# EAGLE design clock (EAGLE 6.4)
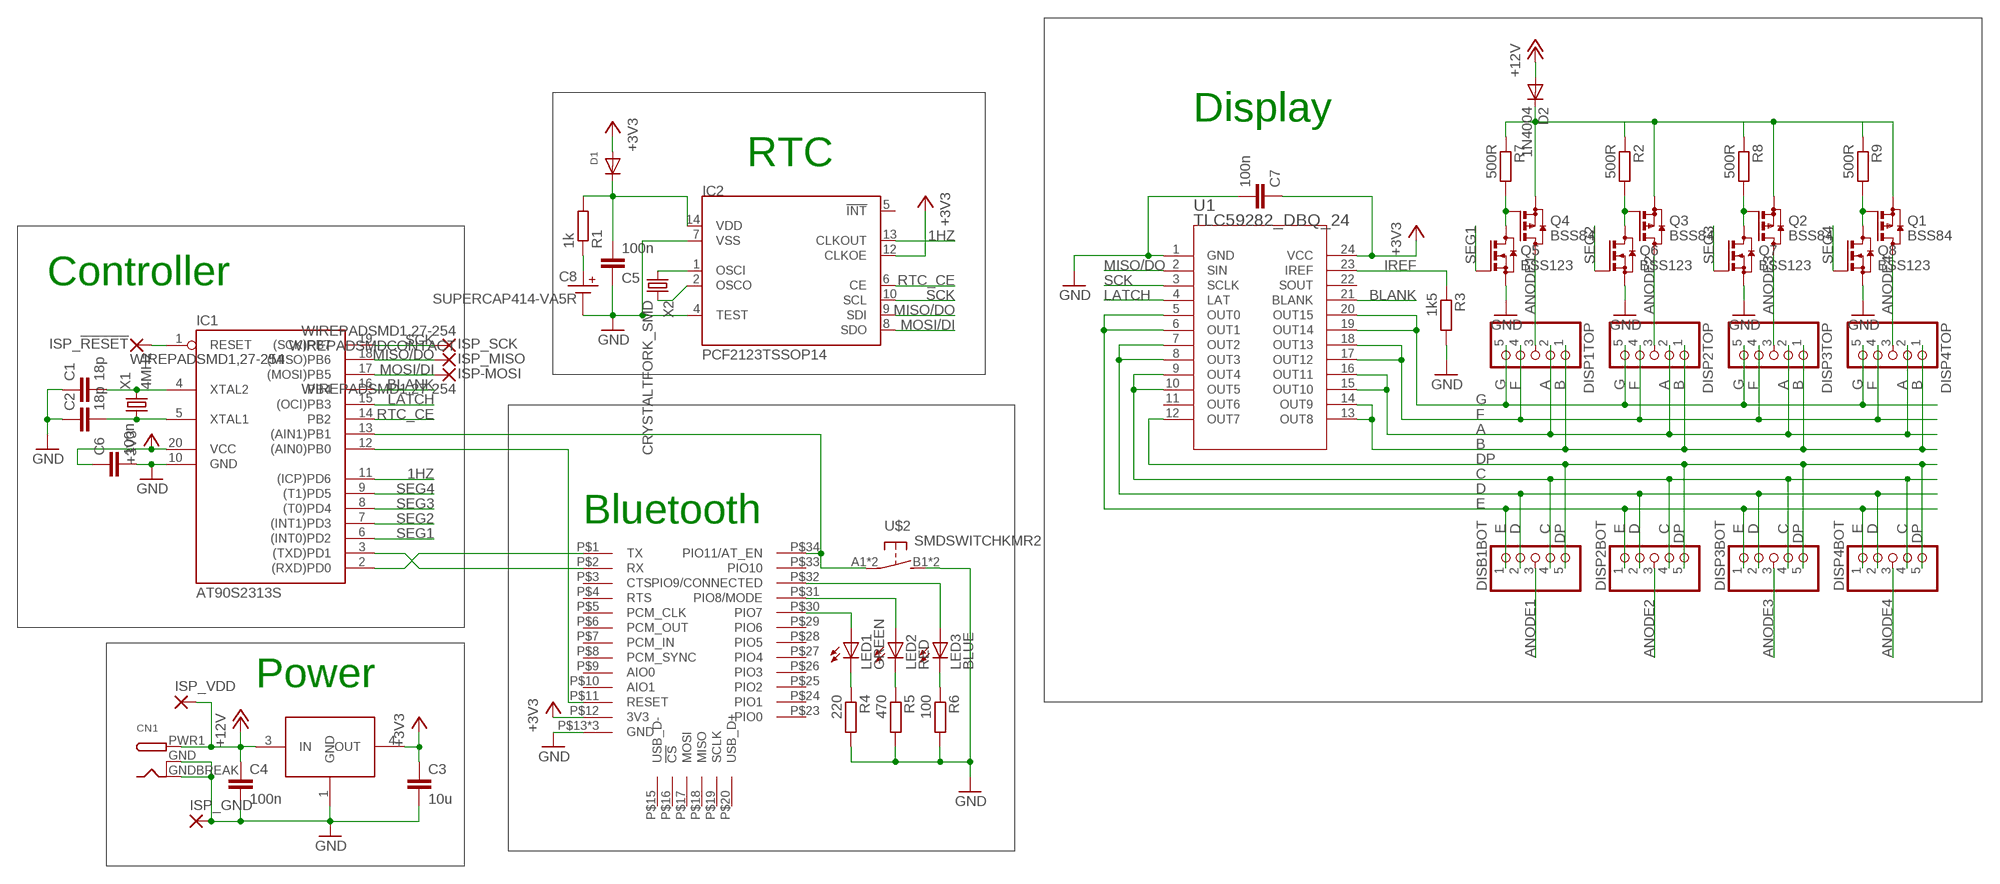
[diagram p0: schematic, sheet 1]

## Parts
C1  18p  C-EUC0603K  [C0603K]
C2  18p  C-EUC0603K  [C0603K]
C3  10u  C-EUC0805K  [C0805K]
C4  100n  C-EUC0603K  [C0603K]
C5  100n  C-EUC0603K  [C0603K]
C6  100n  C-EUC0603K  [C0603K]
C7  100n  C-EUC0603K  [C0603K]
C8  SUPERCAP414-VA5R  [414-VA5R]
CN1  DCBARRELSMT  [DCJACK_2MM_SMT]
D1  DIODESOD-523  [SOD-523]
D2  1N4004  [DO41-10]
DISB1BOT  PINHD-1X5  [1X05WIDE]
DISP1TOP  PINHD-1X5  [1X05WIDE]
DISP2BOT  PINHD-1X5  [1X05WIDE]
DISP2TOP  PINHD-1X5  [1X05WIDE]
DISP3BOT  PINHD-1X5  [1X05WIDE]
DISP3TOP  PINHD-1X5  [1X05WIDE]
DISP4BOT  PINHD-1X5  [1X05WIDE]
DISP4TOP  PINHD-1X5  [1X05WIDE]
IC1  AT90S2313S  [SO20L]
IC2  PCF2123TSSOP14  [TSSOP14]
ISP-MOSI  WIREPADSMD1,27-254  [SMD1,27-2,54]
ISP_!RESET  WIREPADSMD1,27-254  [SMD1,27-2,54]
ISP_GND  WIREPADSMD2,54-2,54  [SMD2,54-2,54]
ISP_MISO  WIREPADSMDCONTACT  [SMDCONTACT]
ISP_SCK  WIREPADSMD1,27-254  [SMD1,27-2,54]
ISP_VDD  WIREPADSMD2,54-2,54  [SMD2,54-2,54]
LED1  GREEN  LEDCHIPLED_0805  [CHIPLED_0805]
LED2  RED  LEDCHIPLED_0805  [CHIPLED_0805]
LED3  BLUE  LEDCHIPLED_0805  [CHIPLED_0805]
Q1  BSS84  [SOT23]
Q2  BSS84  [SOT23]
Q3  BSS84  [SOT23]
Q4  BSS84  [SOT23]
Q5  BSS123  [SOT23]
Q6  BSS123  [SOT23]
Q7  BSS123  [SOT23]
Q8  BSS123  [SOT23]
R1  1k  R-EU_R0603  [R0603]
R2  500R  R-EU_R0603  [R0603]
R3  1k5  R-EU_R0603  [R0603]
R4  220  R-EU_R0603  [R0603]
R5  470  R-EU_R0603  [R0603]
R6  100  R-EU_R0603  [R0603]
R7  500R  R-EU_R0603  [R0603]
R8  500R  R-EU_R0603  [R0603]
R9  500R  R-EU_R0603  [R0603]
U1  TLC59282_DBQ_24  [DBQ24]
U$1  BT-HC-05  [BT-HC-05]
U$2  SMDSWITCHKMR2  [KMR2]
U$3  REGULATORDPAK  [DPAK]
X1  4MHz  CRYSTALHC49UP  [HC49UP]
X2  CRYSTALTFORK_SMD  [TFORK_SMD]

## Nets
1HZ: IC1.11((ICP)PD6) IC2.13(CLKOUT)
+3V3: C3.1 C6.1 C7.1 D1.A IC1.20(VCC) IC2.12(CLKOE) U1.24(VCC) U$1.P$12(3V3) U$3.4(OUT)
+12V: C4.1 CN1.PWR1(PWR) D2.A ISP_VDD.1(P) U$3.3(IN)
A: DISP1TOP.2 DISP2TOP.2 DISP3TOP.2 DISP4TOP.2 U1.15(OUT10) U1.16(OUT11)
ANODE1: DISB1BOT.3 DISP1TOP.3 Q4.3(D)
ANODE2: DISP2BOT.3 DISP2TOP.3 Q3.3(D)
ANODE3: DISP3BOT.3 DISP3TOP.3 Q2.3(D)
ANODE4: DISP4BOT.3 DISP4TOP.3 Q1.3(D)
B: DISP1TOP.1 DISP2TOP.1 DISP3TOP.1 DISP4TOP.1 U1.13(OUT8) U1.14(OUT9)
BLANK: IC1.16(PB4) U1.21(BLANK)
C: DISB1BOT.4 DISP2BOT.4 DISP3BOT.4 DISP4BOT.4 U1.9(OUT4) U1.10(OUT5)
D: DISB1BOT.2 DISP2BOT.2 DISP3BOT.2 DISP4BOT.2 U1.7(OUT2) U1.8(OUT3)
DP: DISB1BOT.5 DISP2BOT.5 DISP3BOT.5 DISP4BOT.5 U1.12(OUT7)
E: DISB1BOT.1 DISP2BOT.1 DISP3BOT.1 DISP4BOT.1 U1.5(OUT0) U1.6(OUT1)
F: DISP1TOP.4 DISP2TOP.4 DISP3TOP.4 DISP4TOP.4 U1.17(OUT12) U1.18(OUT13)
G: DISP1TOP.5 DISP2TOP.5 DISP3TOP.5 DISP4TOP.5 U1.19(OUT14) U1.20(OUT15)
GND: C1.1 C2.1 C3.2 C4.2 C5.1 C6.2 C7.2 C8.MINUS CN1.GND(GNDBREAK) CN1.GNDBREAK(GND) IC1.10(GND) IC2.4(TEST) IC2.7(VSS) ISP_GND.1(P) Q5.2(S) Q6.2(S) Q7.2(S) Q8.2(S) R3.2 R4.2 R5.2 R6.2 U1.1(GND) U$1.P$13(GND) U$1.P$21(GND) U$1.P$22(GND) U$2.B1(S) U$2.B2(S) U$3.1(GND)
IREF: R3.1 U1.23(IREF)
LATCH: IC1.15((OCI)PB3) U1.4(LAT)
MISO/DO: IC1.18((MISO)PB6) IC2.9(SDI) ISP_MISO.1(P) U1.2(SIN)
MOSI/DI: IC1.17((MOSI)PB5) IC2.8(SDO) ISP-MOSI.1(P)
N$1: IC1.2((RXD)PD0) U$1.P$1(TX)
N$2: IC1.3((TXD)PD1) U$1.P$2(RX)
N$3: IC2.2(OSCO) X2.3
N$4: IC2.1(OSCI) X2.2
N$5: C2.2 IC1.5(XTAL1) X1.1
N$6: C1.2 IC1.4(XTAL2) X1.2
N$7: IC1.1(RESET) ISP_!RESET.1(P)
N$8: IC1.13((AIN1)PB1) U$1.P$34(PIO11/AT_EN) U$2.A1(P) U$2.A2(P)
N$9: C8.PLUS R1.1
N$10: IC1.12((AIN0)PB0) U$1.P$11(RESET)
N$11: D2.C Q1.2(S) Q2.2(S) Q3.2(S) Q4.2(S) R2.1 R7.1 R8.1 R9.1
N$13: LED1.C R4.1
N$14: LED2.C R5.1
N$15: LED3.C R6.1
N$16: LED3.A U$1.P$32(PIO9/CONNECTED)
N$17: LED2.A U$1.P$31(PIO8/MODE)
N$18: LED1.A U$1.P$30(PIO7)
N$28: Q1.1(G) Q8.3(D) R9.2
N$29: Q2.1(G) Q7.3(D) R8.2
N$30: Q3.1(G) Q6.3(D) R2.2
N$31: Q4.1(G) Q5.3(D) R7.2
RTC_CE: IC1.14(PB2) IC2.6(CE)
SCK: IC1.19((SCK)PB7) IC2.10(SCL) ISP_SCK.1(P) U1.3(SCLK)
SEG1: IC1.6((INT0)PD2) Q5.1(G)
SEG2: IC1.7((INT1)PD3) Q6.1(G)
SEG3: IC1.8((T0)PD4) Q7.1(G)
SEG4: IC1.9((T1)PD5) Q8.1(G)
VRTC: C5.2 D1.K(C) IC2.14(VDD) R1.2
Unconnected: IC2.5(!INT) U1.11(OUT6) U1.22(SOUT) U$1.P$3(CTS) U$1.P$4(RTS) U$1.P$5(PCM_CLK) U$1.P$6(PCM_OUT) U$1.P$7(PCM_IN) U$1.P$8(PCM_SYNC) U$1.P$9(AIO0) U$1.P$10(AIO1) U$1.P$15(USB_D-) U$1.P$16(!CS) U$1.P$17(MOSI) U$1.P$18(MISO) U$1.P$19(SCLK) U$1.P$20(USB_D+) U$1.P$23(PIO0) U$1.P$24(PIO1) U$1.P$25(PIO2) U$1.P$26(PIO3) U$1.P$27(PIO4) U$1.P$28(PIO5) U$1.P$29(PIO6) U$1.P$33(PIO10)

## Notes on the sheet
- Display
- RTC
- Controller
- Bluetooth
- Power

## Library data of the parts
C1-C7 = rcl:C-EU: CAPACITOR, European symbol
C8 = jocki:SUPERCAP
CN1 = adafruit:DCBARREL: 2.0mm DC Barrel Jack DCJACK_2MM_PTH - Through Hole Jack (4UConnector: 05537)
D1 = adafruit:DIODE: Diode SMADIODE - SMA Surface Mount Package 20V 1A Schottky Diode Digikey: 641-1014-6-ND DO-1N4148 - Through Hole Small Current Diode SOD-123 20V 1 A (.5mV Vf) Schottky Diode - Digikey: MBRX120TPMSCT-ND SOD-323 10V 570mA (.38mV Vf, 3ns) Schottky Diode - Digikey: ZLLS410CT-ND SOD-523 30V 30mA Schottky Diode (RB751S-40TE61) - Digikey: RB751S-40TE61CT-ND SOT23-R/W - SOT23 Package (R = Solder Paste/Reflow Ovens, W = Hand-Soldering) BAT54Film 40V 300mA - Digikey: 497-7162-1-ND
D2 = adafruit:1N4004: DIODE General purpose 1N400x type rectifier (With bigger pads) http://www.ladyada.net/library/pcb/eaglelibrary.html
DISB1BOT DISP1TOP DISP2BOT DISP2TOP DISP3BOT DISP3TOP DISP4BOT DISP4TOP = tlc59282dbq:PINHD-1X5: PIN HEADER
IC1 = atmel:AT90S2313: MICROCONTROLLER 2 Kbytes FLASH 128 bytes SRAM 128 bytes EEPROM UART; OC_FARNELL: unknown; OC_NEWARK: unknown
IC2 = jocki:PCF2123: edit this description Auto generated by make-symbol-device-package-bsdl.ulp Rev. 43 Source:
ISP-MOSI ISP_!RESET ISP_GND ISP_MISO ISP_SCK ISP_VDD = jocki:WIREPAD: Wire PAD connect wire on PCB
LED1-LED3 = adafruit:LED: LED OSRAM: - CHIPLED LG R971, LG N971, LY N971, LG Q971, LY Q971, LO R971, LY R971 LH N974, LH R974 LS Q976, LO Q976, LY Q976 LO Q996 - Hyper CHIPLED LW Q18S LB Q993, LB Q99A, LB R99A - SideLED LS A670, LO A670, LY A670, LG A670, LP A670 LB A673, LV A673, LT A673, LW A673 LH A674 LY A675 LS A676, LA A676, LO A676, LY A676, LW A676 LS A679, LY A679, LG A679 - Hyper Micro SIDELED® LS Y876, LA Y876, LO Y876, LY Y876 LT Y87S - SmartLED LW L88C, LW L88S LB L89C, LB L89S, LG L890 LS L89K, LO L89K, LY L89K LS L896, LA L896, LO L896, LY L896 - TOPLED LS T670, LO T670, LY T670, LG T670, LP T670 LSG T670, LSP T670, LSY T670, LOP T670, LYG T670 LG T671, LOG T671, LSG T671 LB T673, LV T673, LT T673, LW T673 LH T674 LS T676, LA T676, LO T676, LY T676, LB T676, LH T676, LSB T676, LW T676 LB T67C, LV T67C, LT T67C, LS T67K, LO T67K, LY T67K, LW E67C LS E67B, LA E67B, LO E67B, LY E67B, LB E67C, LV E67C, LT E67C LW T67C LS T679, LY T679, LG T679 LS T770, LO T770, LY T770, LG T770, LP T770 LB T773, LV T773, LT T773, LW T773 LH T774 LS E675, LA E675, LY E675, LS T675 LS T776, LA T776, LO T776, LY T776, LB T776 LHGB T686 LT T68C, LB T68C - Hyper Mini TOPLED® LB M676 - Mini TOPLED Santana® LG M470 LS M47K, LO M47K, LY M47K Source: http://www.osram.convergy.de/
Q1-Q4 = transistor-small-signal:BSS84: P-CHANNEL MOS FET
Q5-Q8 = transistor-small-signal:BSS123: N-CHANNEL MOS FET
R1-R9 = rcl:R-EU_: RESISTOR, European symbol
U1 = tlc59282dbq:TLC59282_DBQ_24; DATASHEETURL: http://www.ti.com/lit/gpn/TLC59282; DESCRIPTION: 16-Channel Constant Current LED Driver with 4-Channel Grouped Delay; FAMILY_NAME: LED DRIVER; GENERIC_PART_NUMBER: TLC59282; INDUSTRY_STD_PKG_TYPE: SSOP/QSOP; MANUFACTURER: Texas Instruments; MANUFACTURER_PART_NUMBER: tlc59282_dbq_24; PACKAGE_DESIGNATOR: DBQ; PIN_COUNT: 24; VENDOR: Texas Instruments
U$1 = jocki:BT-HC-05
U$2 = jocki:SMDSWITCH
U$3 = jocki:REGULATOR
X1 = crystal:CRYSTAL: CRYSTAL; OC_FARNELL: unknown; OC_NEWARK: unknown
X2 = jocki:CRYSTAL

## Board
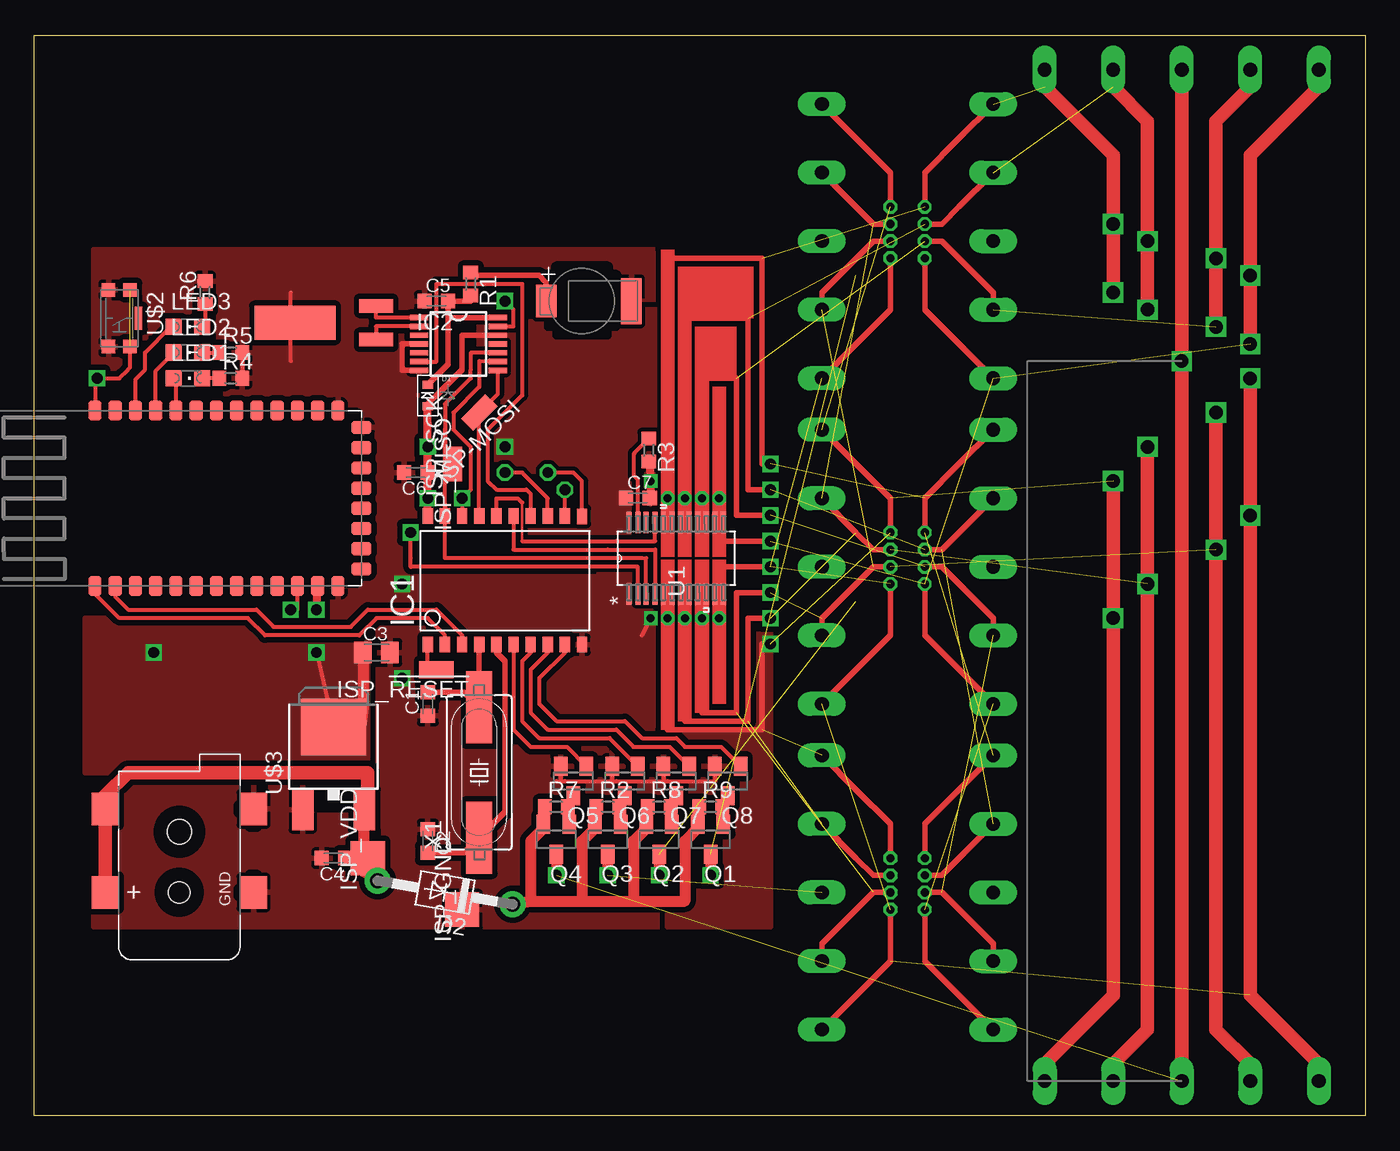
[diagram p1: board, top side]
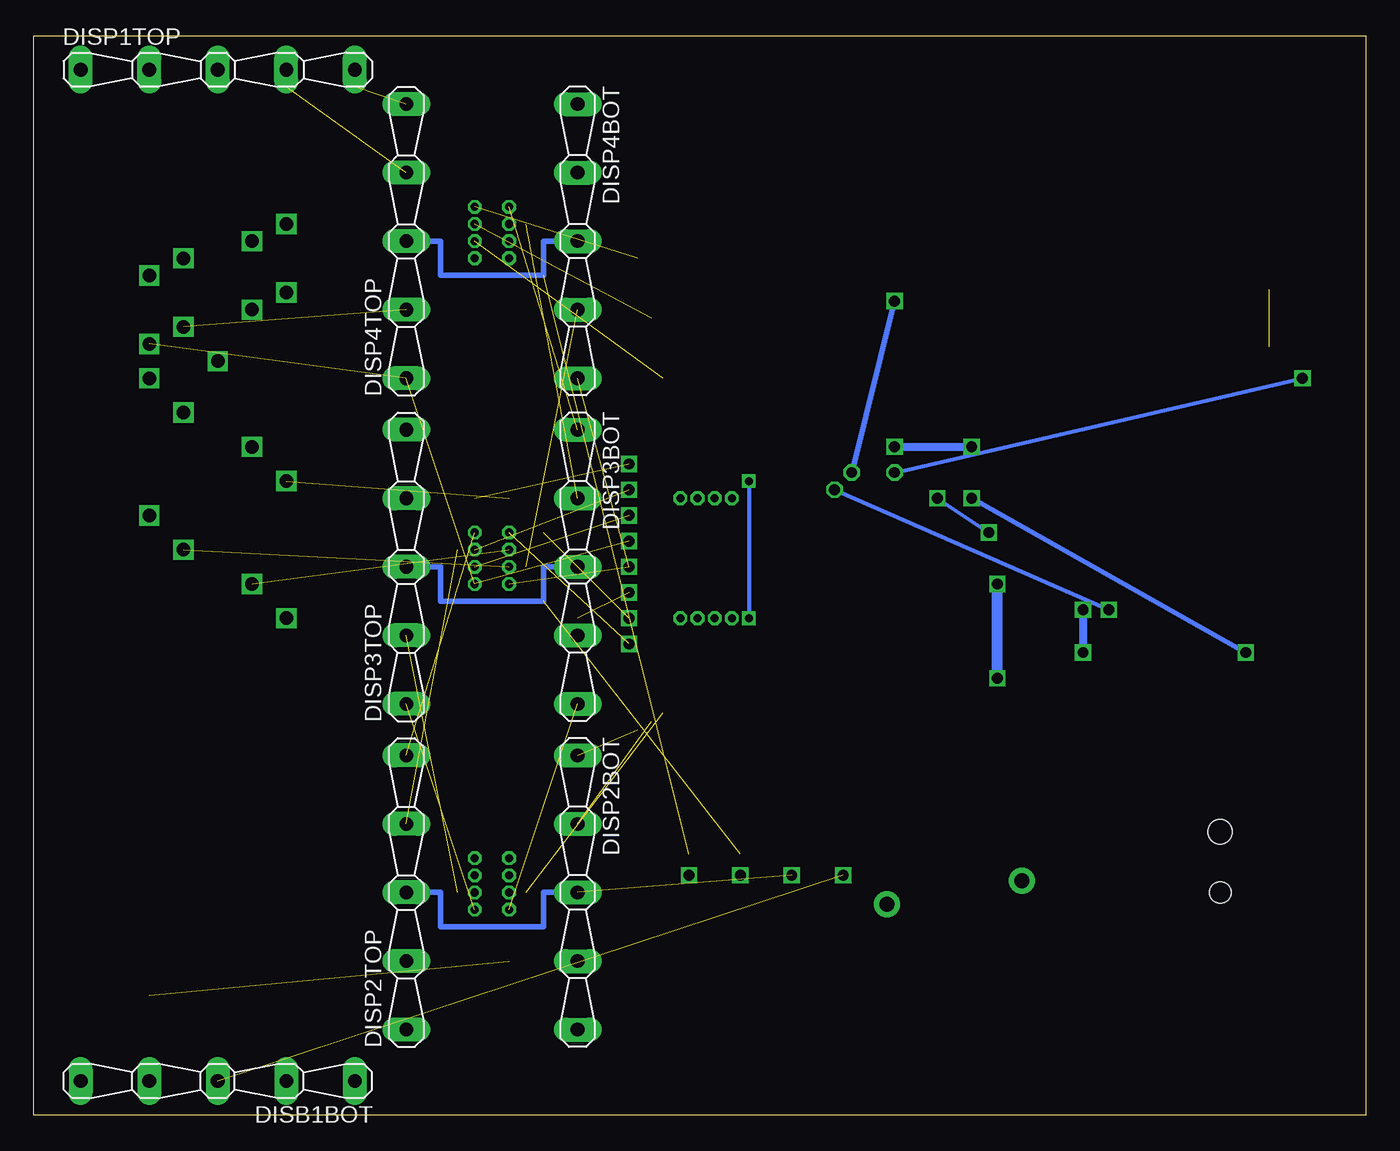
[diagram p2: board, bottom side, seen from below]

Size 98.73 x 80 mm. Coordinates in mm from the lower left corner, seen from the top.
Outline: 0,0 98.73,0 98.73,80 0,80 0,0
Copper layers (1*16): Top 0.035mm / dielectric 1.5mm / Bottom 0.035mm
Design rules "default *": minimum track width 10mil, minimum drill 24mil, track to track 8mil, track to pad 8mil, pad to pad 8mil, via to via 8mil, smd to smd 8mil, copper to edge 40mil, drill to drill 8mil, minimum pad ring 15mil, minimum via ring 8mil, stop-mask expansion 4mil, vias tented up to drill 0mil, thermal gap 10mil
tRestrict: area 21,22.9 to 23.5,24.1; area 38.7,57.8 to 42.5,62.9; area 38.1,58.4 to 43.2,62.2; area 4,39.5 to 24,52

### Footprints (pad centres in the part's own frame; a part is rotated, then mirrored left to right if it is on the bottom)
C0603K = smd 1.05 x 1.08: 1 -0.875,0; 2 0.875,0
C0805K = smd 1.3 x 1.6: 1 -1,0; 2 1,0
414-VA5R = smd 1.5 x 3.4: MINUS 3.65,0 | smd 1.5 x 2.4: PLUS -2.65,0
DCJACK_2MM_SMT = smd 2.4 x 2: GND 0,-5.5; GNDBREAK 6.2,-5.5; PWR1 0,5.5; PWR2 6.2,5.5 | hole 1.6: 0,0 | hole 1.8: 4.5,0
SOD-523 = smd 0.8 x 0.6: A 0,-0.8; K 0,0.8
DO41-10 = drill 1.118 pad 1.93: A 5.08,0; C -5.08,0
1X05WIDE = drill 1.016 long: 1 -10.16,0; 2 -5.08,0; 3 0,0; 4 5.08,0; 5 10.16,0
SO20L = smd 0.762 x 1.143: 1 -5.08,-5.131; 2 -3.81,-5.131; 3 -2.54,-5.131; 4 -1.27,-5.131; 5 0,-5.131; 6 1.27,-5.131; 7 2.54,-5.131; 8 3.81,-5.131; 9 5.08,-5.131; 10 6.35,-5.131; 11 6.35,4.369; 12 5.08,4.394; 13 3.81,4.394; 14 2.54,4.394; 15 1.27,4.394; 16 0,4.394; 17 -1.27,4.394; 18 -2.54,4.394; 19 -3.81,4.394; 20 -5.08,4.394
TSSOP14 = smd 1.35 x 0.4: 1 -2.925,1.95; 2 -2.925,1.3; 3 -2.925,0.65; 4 -2.925,0; 5 -2.925,-0.65; 6 -2.925,-1.3; 7 -2.925,-1.95; 8 2.925,-1.95; 9 2.925,-1.3; 10 2.925,-0.65; 11 2.925,0; 12 2.925,0.65; 13 2.925,1.3; 14 2.925,1.95
SMD1,27-2,54 = smd 1.27 x 2.54: 1 0,0
SMD2,54-2,54 = smd 2.54 x 2.54: 1 0,0
SMDCONTACT = smd 0.254 x 0.254: 1 0,0
CHIPLED_0805 = smd 1.2 x 1.2: A 0,-1.05; C 0,1.05
SOT23 = smd 1 x 1.4: 1 -0.95,-1.1; 2 0.95,-1.1; 3 0,1.1
R0603 = smd 1 x 1.1: 1 -0.85,0; 2 0.85,0
DBQ24 = smd 1.6 x 0.356: 1 -2.642,3.505; 2 -2.642,2.845; 3 -2.642,2.235; 4 -2.642,1.575; 5 -2.642,0.965; 6 -2.642,0.305; 7 -2.642,-0.305; 8 -2.642,-0.965; 9 -2.642,-1.575; 10 -2.642,-2.235; 11 -2.642,-2.845; 12 -2.642,-3.505; 13 2.642,-3.505; 14 2.642,-2.845; 15 2.642,-2.235; 16 2.642,-1.575; 17 2.642,-0.965; 18 2.642,-0.305; 19 2.642,0.305; 20 2.642,0.965; 21 2.642,1.575; 22 2.642,2.235; 23 2.642,2.845; 24 2.642,3.505
BT-HC-05 = smd 1.5 x 1: P$1 -6.5,6.25; P$2 -6.5,4.75; P$3 -6.5,3.25; P$4 -6.5,1.75; P$5 -6.5,0.25; P$6 -6.5,-1.25; P$7 -6.5,-2.75; P$8 -6.5,-4.25; P$9 -6.5,-5.75; P$10 -6.5,-7.25; P$11 -6.5,-8.75; P$12 -6.5,-10.25; P$13 -6.5,-11.75; P$22 6.5,-11.75; P$23 6.5,-10.25; P$24 6.5,-8.75; P$25 6.5,-7.25; P$26 6.5,-5.75; P$27 6.5,-4.25; P$28 6.5,-2.75; P$29 6.5,-1.25; P$30 6.5,0.25; P$31 6.5,1.75; P$32 6.5,3.25; P$33 6.5,4.75; P$34 6.5,6.25 | smd 1 x 1.5: P$14 -5.25,-13.5; P$15 -3.75,-13.5; P$16 -2.25,-13.5; P$17 -0.75,-13.5; P$18 0.75,-13.5; P$19 2.25,-13.5; P$20 3.75,-13.5; P$21 5.25,-13.5
KMR2 = smd 1 x 1: A1 -2.1,0.8; A2 2.1,0.8; B1 -2.1,-0.8; B2 2.1,-0.8 | smd 1.7 x 0.55: GND 0,1.425
DPAK = smd 1.6 x 3: 1 -2.28,-4.04; 3 2.28,-4.04 | smd 4.826 x 4.191: 4 0,2.096
HC49UP = smd 5.334 x 1.93: 1 -4.826,0; 2 4.826,0
TFORK_SMD = smd 6 x 2.5: 1 -3,0 | smd 2.5 x 1: 2 3,1.252; 3 3,-1.252

### Placement (x,y rotation side)
C1  29.21,30.48 90 top
C2  29.21,20.32 270 top
C3  25.4,34.29 0 top
C4  22.23,19.05 180 top
C5  29.84,60.33 0 top
C6  28.32,47.62 180 top
C7  44.78,45.73 0 top
C8  40.64,60.33 0 top
CN1  10.79,16.51 90 top
D1  29.21,53.34 0 top
D2  30.48,16.51 170 top
DISB1BOT  85.09,2.54 180 bottom
DISP1TOP  85.09,77.47 0 bottom
DISP2BOT  58.42,16.51 270 bottom
DISP2TOP  71.12,16.51 90 bottom
DISP3BOT  58.42,40.64 270 bottom
DISP3TOP  71.12,40.64 90 bottom
DISP4BOT  58.42,64.77 270 bottom
DISP4TOP  71.12,64.77 90 bottom
IC1  34.29,40.01 0 top
IC2  31.48,57.15 0 top
ISP-MOSI  33.02,52.07 135 top
ISP_!RESET  29.84,33.02 90 top
ISP_GND  31.75,15.24 0 top
ISP_MISO  31.75,45.72 0 top
ISP_SCK  31.11,48.26 0 top
ISP_VDD  24.77,19.05 0 top
LED1  11.43,54.61 270 top
LED2  11.43,56.52 270 top
LED3  11.43,58.42 270 top
Q1  50.16,20.45 180 top
Q2  46.35,20.45 180 top
Q3  42.55,20.45 180 top
Q4  38.73,20.45 180 top
Q5  40.01,24.77 180 top
Q6  43.81,24.77 180 top
Q7  47.62,24.77 180 top
Q8  51.44,24.77 180 top
R1  32.38,61.59 270 top
R2  42.55,22.86 0 top
R3  45.59,49.28 270 top
R4  14.61,54.61 0 top
R5  14.61,56.52 0 top
R6  12.7,60.96 90 top
R7  38.73,22.86 0 top
R8  46.35,22.86 0 top
R9  50.16,22.86 0 top
U1  47.62,41.27 90 top
U$1  10.79,45.72 90 top
U$2  6.35,59.05 270 top
U$3  22.23,26.67 0 top
X1  33.02,25.4 90 top
X2  22.38,58.72 0 top

### Tracks (layer width: path | path; a pad name or v marks a point on that pad's centre or on a via)
1HZ  (via drill 0.8)
  Top 0.305: IC2.13 35.56,58.45 35.56,59.05 35.56,59.48 35.56,59.69 v34.92,60.33 | IC1.11 40.64,46.99 40.01,47.62 v38.1,47.62
  Bottom 0.406: v38.1,47.62 v34.92,60.33
+3V3  (via drill 0.8)
  Top 0.305: U$1.P$12 20.95,39.22 | v20.95,34.29 U$3.4
  Top 0.406: 23.05,27.94 U$3.4 | D1.A 29.05,52.54 29.21,52.7 29.84,53.34 31.75,55.24 31.75,57.8 IC2.12
  Top 0.61: 20.95,39.22 v20.95,37.47 | IC1.20 v29.21,45.72 29.21,46.99 | 29.21,46.99 29.21,47.57 | 29.21,47.57 C6.1 | C6.1 29.21,46.99 | v29.21,49.53 29.21,48.9 | 29.21,48.9 29.21,51.27 D1.A | 29.21,46.99 29.21,47.57 | 29.21,47.57 C6.1 | C6.1 29.21,48.26 29.21,48.9
  Top 0.813: C3.1 24.4,30.21 24.13,27.94 23.05,27.94
  Bottom 0.406: v8.89,34.29 v29.21,45.72
  Bottom 0.61: v20.95,37.47 v20.95,34.29 | v34.92,49.53 v29.21,49.53
  pour Top (isolate 0.406, no thermals): 3.81,25.4 3.81,36.83 24.77,36.83 24.77,25.4
  pour Top (isolate 0.305, no thermals): 46.99,43.18 46.99,59.69 33.02,59.69 33.02,43.18
+12V
  Top 0.406: C4.1 24.5,19.05
  Top 0.813: 24.5,19.05 U$3.3 | D2.A 24.5,18.04 24.5,19.05 | 24.5,19.05 ISP_VDD.1
  Top 1.016: CN1.PWR1 5.29,23.71 6.99,25.4 24.77,25.4 24.77,21.59 U$3.3
A  (via drill 0.6, 0.8, 1)  (4 unrouted)
  Top 0.406: DISP4TOP.2 71.12,60.96 67.31,64.77 v66.04,64.77 | v54.61,44.45 52.07,44.45 52.07,54.61 49.53,54.61 v49.53,45.72 49.53,43.92 | DISP3TOP.2 71.12,36.83 67.31,40.64 v66.04,40.64 | DISP2TOP.2 71.12,12.7 67.31,16.51 v66.04,16.51 | 49.53,43.92 U1.16 | 49.53,43.92 U1.15
  Top 1.016: DISP1TOP.2 90.17,76.2 87.63,73.66 v87.63,63.5 v87.63,58.42
ANODE1  (via drill 0.8, 1)  (1 unrouted)
  Top 0.813: Q4.3 v38.73,17.78
  Top 1.016: DISP1TOP.3 v85.09,55.88 DISB1BOT.3
ANODE2  (via drill 0.8)  (1 unrouted)
  Top 0.813: Q3.3 v42.55,17.78
  Bottom 0.406: DISP2TOP.3 68.58,16.51 68.58,13.97 60.96,13.97 60.96,16.51 DISP2BOT.3
ANODE3  (via drill 0.8)  (1 unrouted)
  Top 0.813: Q2.3 v46.35,17.78
  Bottom 0.406: DISP3TOP.3 68.58,40.64 68.58,38.1 60.96,38.1 60.96,40.64 DISP3BOT.3
ANODE4  (via drill 0.8)  (1 unrouted)
  Top 0.813: Q1.3 v50.16,17.78
  Bottom 0.406: DISP4TOP.3 68.58,64.77 68.58,62.23 60.96,62.23 60.96,64.77 DISP4BOT.3
B  (via drill 0.6, 0.8, 1)  (4 unrouted)
  Top 0.406: DISP4TOP.1 66.04,59.69 v66.04,63.5 | 50.8,43.92 50.8,42.55 v54.61,42.55 | DISP3TOP.1 66.04,35.56 v66.04,39.37 | DISP2TOP.1 66.04,11.43 v66.04,15.24 | v50.8,45.72 50.8,44.45 | 50.8,44.45 50.8,43.92 | 50.8,43.92 U1.13 | U1.14 50.47,44.45 50.8,44.45
  Top 1.016: DISP1TOP.1 95.25,76.2 90.17,71.12 v90.17,62.23 v90.17,57.15
BLANK
  Top 0.2: 36.2,45.4 36.2,42.55
  Top 0.305: IC1.16 34.29,45.72 35.88,45.72 36.2,45.4 | 36.2,42.55 43.18,42.55 46.05,42.55 U1.21
C  (via drill 0.6, 0.8, 1)  (4 unrouted)
  Top 0.406: v63.5,64.77 62.23,64.77 58.42,60.96 DISP4BOT.4 | v54.61,38.73 52.07,38.73 52.07,29.84 49.53,29.84 v49.53,36.83 49.53,38.63 | v63.5,40.64 62.23,40.64 58.42,36.83 DISP3BOT.4 | v63.5,16.51 62.23,16.51 58.42,12.7 DISP2BOT.4 | 49.53,38.63 U1.9 | 49.53,38.63 U1.10
  Top 1.016: DISB1BOT.4 90.17,3.81 87.63,6.35 v87.63,41.91 v87.63,52.07
D  (via drill 0.6, 0.8, 1)  (4 unrouted)
  Top 0.406: v63.5,66.04 62.23,66.04 60.96,67.31 DISP4BOT.2 | v54.61,36.83 52.95,36.83 52.95,29.21 48.26,29.21 v48.26,36.83 48.26,38.63 | v63.5,41.91 62.23,41.91 60.96,43.18 DISP3BOT.2 | v63.5,17.78 62.23,17.78 60.96,19.05 DISP2BOT.2 | 48.26,38.63 U1.8 | 48.26,38.63 U1.7
  Top 1.016: DISB1BOT.2 80.01,3.81 82.55,6.35 v82.55,39.37 v82.55,49.53
DP  (via drill 0.6, 0.8, 1)  (4 unrouted)
  Top 0.406: v63.5,63.5 63.5,59.69 DISP4BOT.5 | v54.61,40.64 50.8,40.64 v50.8,36.83 50.8,38.63 U1.12 | v63.5,39.37 63.5,35.56 DISP3BOT.5 | v63.5,15.24 63.5,11.43 DISP2BOT.5
  Top 1.016: DISB1BOT.5 95.25,3.81 90.17,8.89 v90.17,44.45 v90.17,54.61
E  (via drill 0.6, 0.8, 1)  (4 unrouted)
  Top 0.406: v63.5,67.31 63.5,69.85 60.96,72.39 DISP4BOT.1 | v54.61,34.92 53.98,34.92 53.98,28.57 46.99,28.57 v46.99,36.83 46.99,38.1 | DISP3BOT.1 63.5,45.72 v63.5,43.18 | v63.5,19.05 63.5,21.59 60.96,24.13 DISP2BOT.1 | 46.99,38.1 46.99,38.63 U1.5 | U1.6 47.32,38.1 46.99,38.1
  Top 1.016: DISB1BOT.1 74.93,3.81 80.01,8.89 v80.01,36.83 v80.01,46.99
  pour Top (isolate 0.406): 46.99,41.91 46.99,13.97 54.61,13.97 54.61,41.91
F  (via drill 0.6, 0.8, 1)  (4 unrouted)
  Top 0.406: DISP4TOP.4 68.58,67.31 67.31,66.04 v66.04,66.04 | v54.61,46.35 52.95,46.35 52.95,59.05 48.26,59.05 v48.26,45.72 48.26,44.45 | DISP3TOP.4 67.31,41.91 v66.04,41.91 | DISP2TOP.4 68.58,19.05 67.31,17.78 v66.04,17.78 | 48.26,44.45 48.26,43.92 U1.17 | U1.18 47.93,44.45 48.26,44.45
  Top 1.016: DISP1TOP.4 80.01,76.2 82.55,73.66 v82.55,64.77 v82.55,59.69
G  (via drill 0.6, 0.8, 1)  (4 unrouted)
  Top 0.406: DISP4TOP.5 68.58,72.39 66.04,69.85 v66.04,67.31 | v54.61,48.26 53.98,48.26 53.98,63.5 46.99,63.5 v46.99,45.72 46.99,43.92 | DISP3TOP.5 68.58,48.26 66.04,45.72 v66.04,43.18 | DISP2TOP.5 68.58,24.13 66.04,21.59 v66.04,19.05 | 46.99,43.92 U1.20 | 46.99,43.92 U1.19
  Top 1.016: DISP1TOP.5 74.93,76.2 80.01,71.12 v80.01,66.04 v80.01,60.96
GND  (via drill 0.6, 0.8)
  Top 0.305: R5.2 R4.2 | v45.72,36.83 45.09,35.56 | 19.05,55.88 19.05,60.96 | 38.73,24.77 39.37,24.77 | 39.37,24.77 43.18,24.77 | 43.18,24.77 46.99,24.77 | Q5.2 39.05,24.77 39.37,24.77 | Q6.2 42.87,24.77 43.18,24.77 | Q7.2 46.67,24.77 46.99,24.77 | Q8.2 50.48,24.77 46.99,24.77
  Top 0.406: IC2.4 27.3,57.15 27.3,55.2 IC2.7
  Top 0.61: R3.2 45.72,48.3 v45.72,46.99 45.72,45.8 C7.2
  Bottom 0.305: v45.72,46.99 v45.72,36.83
  Bottom 0.813: v27.3,32.38 v27.3,39.37
  pour Top (isolate 0.406, rank 2): 4.45,13.97 54.61,13.97 54.61,64.14 4.45,64.14
  pour Top (isolate 0.254, no thermals): 41.91,40.64 41.91,36.83 45.72,36.83 45.72,40.64
IREF
  Top 0.305: U1.23 44.78,47.1 44.5,47.38 44.5,49 44.5,49.05 R3.1
LATCH
  Top 0.305: IC1.15 35.56,41.91 42.55,41.91 46.05,41.91 U1.4
MISO/DO  (via drill 0.8)
  Top 0.305: U1.2 44.78,40.64 27.94,40.64 27.94,41.27 v27.94,43.18 | IC1.18 ISP_MISO.1 32.38,46.35 32.38,49.53 31.11,50.8 31.11,52.07 33.02,53.98 33.02,55.88 IC2.9
  Bottom 0.305: ISP_MISO.1 v27.94,43.18
  other vias: 31.75,45.72
MOSI/DI
  Top 0.305: IC1.17 ISP-MOSI.1 34.41,53.45 IC2.8
N$1
  Top 0.305: IC1.2 30.48,35.56 29.21,36.83 25.4,36.83 24.13,35.56 17.14,35.56 15.88,36.83 6.35,36.83 4.45,38.73 4.45,39.12 U$1.P$1
N$2
  Top 0.305: IC1.3 31.75,35.56 29.84,37.47 24.77,37.47 23.5,36.2 17.78,36.2 16.51,37.47 6.99,37.47 6.04,38.41 U$1.P$2
N$3
  Top 0.305: IC2.2 25.38,58.45 X2.3
N$4
  Top 0.305: IC2.1 25.38,59.1 X2.2
N$5
  Top 0.406: C2.2 31.89,19.45 X1.1 34.92,22.48 34.92,33.66 34.29,34.29 IC1.5
N$6
  Top 0.406: C1.2 31.89,31.36 X1.2 IC1.4
N$7
  Top 0.305: ISP_!RESET.1 29.21,33.02 IC1.1
N$8  (via drill 0.8)  (1 unrouted)
  Top 0.305: IC1.13 38.1,45.72 36.2,47.62 v34.92,47.62 | U$1.P$34 4.54,54.61 v4.7,54.61 6.35,54.61 6.99,55.24 7.15,55.41 U$2.A2
  Bottom 0.305: v34.92,47.62 v4.7,54.61
N$9
  Top 0.305: R1.1 32.6,62.23
  Top 0.406: 32.6,62.23 37.47,62.23 37.99,61.7 C8.PLUS
N$10  (via drill 0.8)
  Top 0.305: IC1.12 39.37,45.72 v39.37,46.35 | v19.05,37.47 19.55,37.47 U$1.P$11
  Bottom 0.305: v39.37,46.35 v19.05,37.47
N$11
  Top 0.305: Q4.2 37.78,22.76 R7.1 | Q3.2 41.59,22.76 R2.1 | Q2.2 45.41,22.76 R8.1 | Q1.2 49.22,22.76 R9.1
  Top 0.813: D2.C 36.83,15.88 | 36.83,15.88 40.64,15.88 | 40.64,15.88 44.45,15.88 | 44.45,15.88 48.26,15.88 48.26,20.32 49.22,21.27 Q1.2 | Q2.2 45.41,21.27 44.45,20.32 44.45,15.88 | Q3.2 41.59,21.27 40.64,20.32 40.64,15.88 | Q4.2 37.78,21.27 36.83,20.32 36.83,15.88
N$12  (via drill 0.7)
  other vias: 10.79,16.51
N$13
  Top 0.305: R4.1 LED1.C
N$14
  Top 0.305: LED2.C R5.1
N$15
  Top 0.305: R6.1 12.7,58.64 LED3.C
N$16
  Top 0.305: U$1.P$32 7.54,54.53 8.26,55.24 8.26,56.52 10.16,58.42 LED3.A
N$17
  Top 0.305: U$1.P$31 9.04,55.18 LED2.A
N$18
  Top 0.305: U$1.P$30 10.54,54.14 LED1.A
N$19  (via drill 0.7)
  other vias: 10.79,21.01
N$28
  Top 0.305: Q1.1 51.12,22.76 R9.2 51.02,23.25 Q8.3
N$29
  Top 0.305: Q2.1 47.3,22.76 R8.2 47.2,23.25 Q7.3
N$30
  Top 0.305: Q3.1 43.49,22.76 R2.2 43.4,23.25 Q6.3
N$31
  Top 0.305: Q4.1 39.69,22.76 R7.2 39.59,23.25 Q5.3
RTC_CE
  Top 0.305: IC2.6 29.84,55.85 29.84,61.59 36.2,61.59 36.2,53.34 33.66,50.8 33.66,46.99 34.29,46.35 36.51,46.35 36.83,46.04 IC1.14
SCK
  Top 0.254: 45.39,41.27 45.09,41.27
  Top 0.305: IC2.10 32.38,56.5 32.38,55.24 32.38,54.61 30.48,52.7 30.48,50.8 | 30.48,48.26 30.48,45.09 IC1.19 30.48,41.27 41.91,41.27 45.09,41.27 | U1.3 45.39,41.27 | 30.48,50.8 30.48,48.9 30.48,48.26 | ISP_SCK.1 30.48,48.26 | 30.48,48.26 30.48,50.8
SEG1
  Top 0.305: IC1.6 35.56,28.57 36.83,27.3 39.52,27.3 Q5.1
SEG2
  Top 0.305: IC1.7 36.83,34.29 36.2,33.66 36.2,29.21 37.47,27.94 42.69,27.94 Q6.1
SEG3
  Top 0.305: IC1.8 38.1,34.29 36.83,33.02 36.83,29.84 38.1,28.57 43.18,28.57 44.45,27.3 47.13,27.3 Q7.1
SEG4
  Top 0.305: IC1.9 39.37,34.29 37.47,32.38 37.47,30.48 38.73,29.21 43.81,29.21 45.09,27.94 47.62,27.94 48.26,27.3 50.95,27.3 Q8.1
VRTC
  Top 0.406: D1.K 30.72,55.65 30.72,59.1 | 30.72,59.1 30.72,59.69 | 30.72,59.69 C5.2 32.38,60.33 R1.2 | IC2.14 30.72,59.1 | 30.72,59.1 30.72,59.69
(copper drawn outside any net)
  shapes: Top area x10